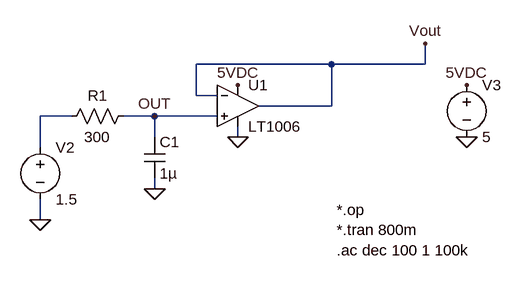
[diagram p0: schematic regla_digital2.asc]
regla_digital2.asc, the LTspice schematic file:
Version 4
SHEET 1 880 680
WIRE 96 256 -112 256
WIRE 240 256 240 224
WIRE 240 256 96 256
WIRE -112 304 -112 256
WIRE -80 304 -112 304
WIRE 96 320 96 256
WIRE 96 320 -16 320
WIRE -304 336 -352 336
WIRE -176 336 -224 336
WIRE -80 336 -176 336
WIRE -176 368 -176 336
WIRE -48 368 -48 352
WIRE -352 384 -352 336
WIRE -176 448 -176 432
WIRE -352 496 -352 464
FLAG -352 496 0
FLAG 240 224 Vout
FLAG 304 368 0
FLAG -176 448 0
FLAG -176 336 OUT
FLAG -48 368 0
FLAG -48 288 5VDC
FLAG 304 288 5VDC
SYMBOL res -320 352 R270
WINDOW 0 32 56 VTop 2
WINDOW 3 0 56 VBottom 2
SYMATTR InstName R1
SYMATTR Value 300
SYMBOL voltage -352 368 R0
SYMATTR InstName V2
SYMATTR Value 1.5
SYMATTR Value2 AC 1.5
SYMBOL voltage 304 272 R0
SYMATTR InstName V3
SYMATTR Value 5
SYMBOL Opamps/LT1006 -48 256 R0
SYMATTR InstName U1
SYMBOL cap -192 368 R0
SYMATTR InstName C1
SYMATTR Value 1µ
TEXT 104 480 Left 2 !*.op\n*.tran 800m\n.ac dec 100 1 100k

The netlist it stands for:
* regla_digital2.asc
R1 N001 OUT 300
V2 N001 0 1.5 AC 1.5
V3 5VDC 0 5
XU1 OUT Vout 5VDC 0 Vout LT1006  ; pins In+ In- V+ V- OUT
C1 OUT 0 1µ
*.op
*.tran 800m
.ac dec 100 1 100k
.lib LTC.lib
.backanno
.end